# EAGLE design BATT_FLEXX (EAGLE 9.6.2)
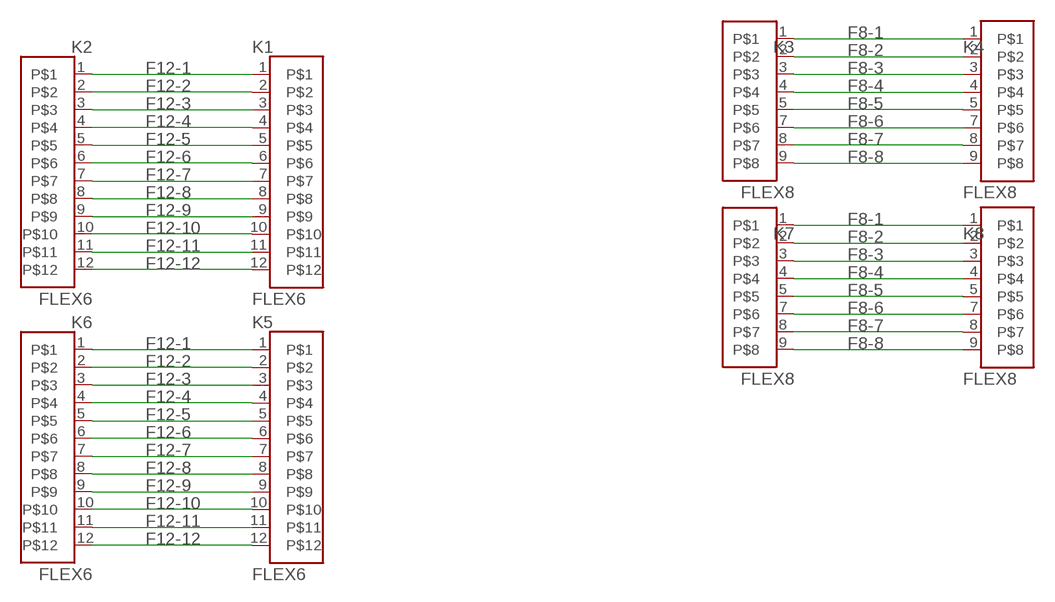
[diagram p0: schematic, sheet 1]

## Parts
K1  FLEX6  [FLEX6]
K2  FLEX6  [FLEX6]
K3  FLEX8  [FLEX8]
K4  FLEX8  [FLEX8]
K5  FLEX6  [FLEX6]
K6  FLEX6  [FLEX6]
K7  FLEX8  [FLEX8]
K8  FLEX8  [FLEX8]

## Nets
F8-1: K3.1 K4.1 K7.1 K8.1
F8-2: K3.2 K4.2 K7.2 K8.2
F8-3: K3.3 K4.3 K7.3 K8.3
F8-4: K3.4 K4.4 K7.4 K8.4
F8-5: K3.5 K4.5 K7.5 K8.5
F8-6: K3.7 K4.7 K7.7 K8.7
F8-7: K3.8 K4.8 K7.8 K8.8
F8-8: K3.9 K4.9 K7.9 K8.9
F12-1: K1.1 K2.1 K5.1 K6.1
F12-2: K1.2 K2.2 K5.2 K6.2
F12-3: K1.3 K2.3 K5.3 K6.3
F12-4: K1.4 K2.4 K5.4 K6.4
F12-5: K1.5 K2.5 K5.5 K6.5
F12-6: K1.6 K2.6 K5.6 K6.6
F12-7: K1.7 K2.7 K5.7 K6.7
F12-8: K1.8 K2.8 K5.8 K6.8
F12-9: K1.9 K2.9 K5.9 K6.9
F12-10: K1.10 K2.10 K5.10 K6.10
F12-11: K1.11 K2.11 K5.11 K6.11
F12-12: K1.12 K2.12 K5.12 K6.12

## Library data of the parts
K1 K2 K5 K6 = Flex:FLEX6: WR-FPC 1mm SMT Horiz. Bot. Contact Hinge type WR-FPC 1mm 06 pins Hinge type SMT Horizontal Bottom Contact ;=>Code : Con_FPC_ZIF_1.00_6861xx148922_686106148922 <http://katalog.we-online.de/media/images/eican/Con_FPC_ZIF_1.00_686110148922_pf2.jpg> Details see: http://katalog.we-online.de/em/datasheet/6861xx148922.pdf Created 2014-10-08, Karrer Zheng 2014 (C) Wurth Elektronik
K3 K4 K7 K8 = Flex_3mm:FLEX8: WR-FPC 1mm SMT Horiz. Bot. Contact Hinge type WR-FPC 1mm 08 pins Hinge type SMT Horizontal Bottom Contact ;=>Code : Con_FPC_ZIF_1.00_6861xx148922_686108148922 <http://katalog.we-online.de/media/images/eican/Con_FPC_ZIF_1.00_686110148922_pf2.jpg> Details see: http://katalog.we-online.de/em/datasheet/6861xx148922.pdf Created 2014-10-08, Karrer Zheng 2014 (C) Wurth Elektronik

## Board
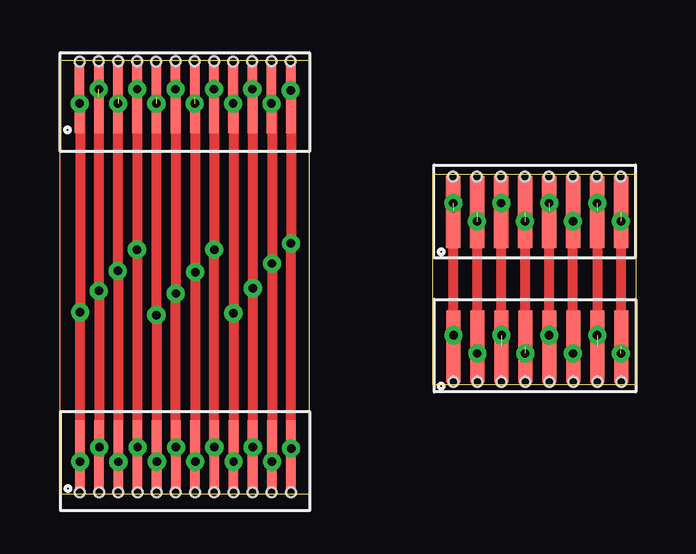
[diagram p1: board, top side]
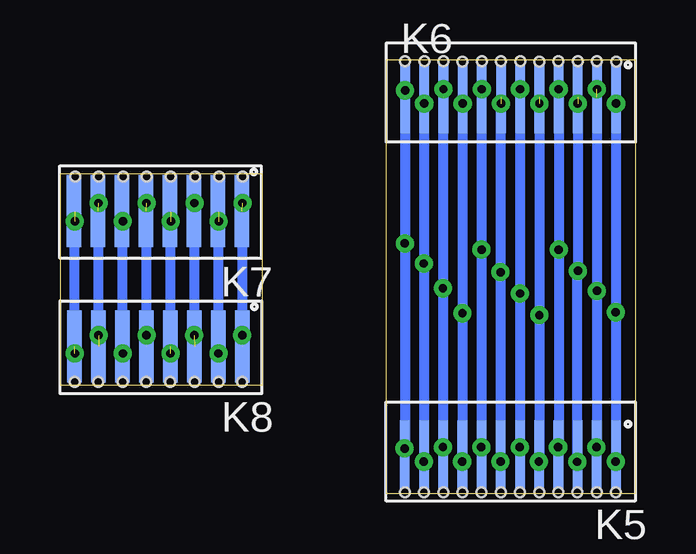
[diagram p2: board, bottom side, seen from below]

Size 24.01 x 18.1 mm. Coordinates in mm from the lower left corner, seen from the top.
Outline: 0,18.1 10.4,18.1 10.4,0 0,0 0,18.1
Outline: 15.56,13.35 24.01,13.35 24.01,4.55 15.56,4.55 15.56,13.35
Copper layers (1*16): Top 0.035mm / dielectric 1.5mm / Bottom 0.035mm
Design rules "default *": minimum track width 6mil, minimum drill 0.35mm, track to track 6mil, track to pad 6mil, pad to pad 6mil, via to via 6mil, smd to smd 6mil, copper to edge 8mil, drill to drill 6mil, minimum pad ring 10mil, minimum via ring 8mil, stop-mask expansion 4mil, vias tented up to drill 50mil, thermal gap 10mil
Holes 0.4 mm at 16.41,4.67 17.4,4.67 18.4,4.67 19.41,4.67 20.41,4.67 21.4,4.67 22.41,4.67 23.4,4.67 16.39,13.23 17.38,13.23 18.38,13.23 19.39,13.23 20.39,13.23 21.38,13.23 22.39,13.23 23.38,13.23 0.83,0.06 1.63,0.07 2.43,0.07 3.23,0.07 4.03,0.06 4.83,0.07 5.63,0.07 6.43,0.07 7.23,0.06 8.03,0.07 8.83,0.07 9.63,0.07 0.82,18.03 1.62,18.04 2.42,18.04 3.22,18.04 4.02,18.03 4.82,18.04 5.62,18.04 6.42,18.04 7.22,18.03 8.02,18.04 8.82,18.04 9.62,18.04

### Footprints (pad centres in the part's own frame; a part is rotated, then mirrored left to right if it is on the bottom)
FLEX6 = smd 0.4 x 3: 1 -2.5,-0.25; 2 -1.7,-0.25; 3 -0.9,-0.25; 4 -0.1,-0.25; 5 0.7,-0.25; 6 1.5,-0.25; 7 2.3,-0.25; 8 3.1,-0.25; 9 3.9,-0.25; 10 4.7,-0.25; 11 5.5,-0.25; 12 6.3,-0.25
FLEX8 = smd 0.6 x 3: 1 0.8,2.05; 2 1.8,2.05; 3 2.8,2.05; 4 3.8,2.05; 5 4.8,2.05; 7 5.8,2.05; 8 6.8,2.05; 9 7.8,2.05

### Placement (x,y rotation side)
K1  3.33,1.82 0 top
K2  3.32,16.79 0 top
K3  15.61,4.1 0 top
K4  15.59,9.7 0 top
K5  3.33,1.32 180 bottom
K6  3.32,16.29 180 bottom
K7  15.62,13.84 180 bottom
K8  15.6,8.2 180 bottom

### Tracks (layer width: path | path; a pad name or v marks a point on that pad's centre or on a via)
F8-1  (via drill 0.35)  (2 unrouted)
  Top 0.406: K4.1 16.41,11.74 K8.1 v16.41,6.62
  Bottom 0.406: K8.1 16.4,11.77 K7.1
  other vias: 16.4,12.13
F8-2  (via drill 0.35)  (2 unrouted)
  Top 0.406: K4.2 17.41,11.74 K8.2 v17.41,5.87 v17.4,5.86
  Bottom 0.406: K8.2 17.4,11.77 K7.2
  other vias: 17.39,11.37
F8-3  (via drill 0.35)  (2 unrouted)
  Top 0.406: K8.3 18.41,11.74 K4.3 v18.4,12.12 v18.4,12.13
  Bottom 0.406: K8.3 18.4,11.77 K7.3
  other vias: 18.41,6.62
F8-4  (via drill 0.35)  (3 unrouted)
  Top 0.406: K8.4 K4.4
  Bottom 0.406: K8.4 19.4,11.77 K7.4
  other vias: 19.39,11.37 19.4,5.86
F8-5  (via drill 0.35)  (2 unrouted)
  Top 0.406: K4.5 20.41,11.74 K8.5 v20.4,6.62
  Bottom 0.406: K8.5 20.4,11.77 K7.5
  other vias: 20.4,12.13
F8-6  (via drill 0.35)  (1 unrouted)
  Top 0.406: v21.39,5.86 21.41,5.88 K8.7 K4.7 v21.4,11.38 v21.39,11.37
  Bottom 0.406: K8.7 21.4,11.77 K7.7
F8-7  (via drill 0.35)  (3 unrouted)
  Top 0.406: K4.8 22.41,11.74 K8.8
  Bottom 0.406: K8.8 22.4,11.77 K7.8
  other vias: 22.4,12.13 22.4,6.62
F8-8  (via drill 0.35)  (3 unrouted)
  Top 0.406: K8.9 23.41,11.74 K4.9
  Bottom 0.406: K8.9 23.4,11.77 K7.9
  other vias: 23.39,5.86 23.39,11.37
F12-1  (via drill 0.35)  (2 unrouted)
  Top 0.406: K6.1 0.84,16.52 v0.84,7.58 v0.83,7.57 v0.83,1.36 v0.84,1.35
  Bottom 0.406: K5.1 v0.84,7.58 0.84,16.26 v0.82,16.28
F12-2  (via drill 0.35)  (2 unrouted)
  Top 0.406: K5.2 v1.63,8.46 v1.62,8.47 K6.2
  Bottom 0.406: K6.2 v1.62,8.47 1.62,1.97 v1.64,1.95
  other vias: 1.62,16.88
F12-3  (via drill 0.35)  (2 unrouted)
  Top 0.406: K6.3 v2.41,9.3 2.43,9.28 v2.43,1.35 v2.44,1.34
  Bottom 0.406: K5.3 2.43,9.3 v2.41,9.3 K6.3
  other vias: 2.42,16.28
F12-4  (via drill 0.35)  (2 unrouted)
  Top 0.406: K5.4 3.23,10.17 v3.21,10.19 v3.21,16.87 v3.22,16.88
  Bottom 0.406: K6.4 v3.21,10.19 3.21,1.98 v3.24,1.95
F12-5  (via drill 0.35)  (2 unrouted)
  Top 0.406: K6.5 v4.02,7.46 v4.03,7.45 v4.03,1.36 v4.04,1.35
  Bottom 0.406: K6.5 v4.02,7.46 K5.5
  other vias: 4.02,16.28
F12-6  (via drill 0.35)  (2 unrouted)
  Top 0.406: K5.6 v4.83,8.36 v4.83,16.87 v4.82,16.88
  Bottom 0.406: v4.84,1.95 v4.83,1.96 v4.83,8.36 K6.6
F12-7  (via drill 0.35)  (2 unrouted)
  Top 0.406: K6.7 v5.63,9.26 v5.64,9.25 v5.63,9.24 5.63,1.37 v5.64,1.36 v5.64,1.35
  Bottom 0.406: K5.7 v5.64,9.25 5.64,16.52 K6.7
  other vias: 5.62,16.28
F12-8  (via drill 0.35)  (2 unrouted)
  Top 0.406: K5.8 v6.43,10.19 v6.43,16.87 v6.42,16.88
  Bottom 0.406: v6.44,1.95 v6.43,1.96 v6.43,10.19 K6.8
F12-9  (via drill 0.35)  (2 unrouted)
  Top 0.406: K6.9 v7.23,7.54 v7.23,1.36 v7.24,1.35
  Bottom 0.406: K5.9 v7.23,7.54 v7.23,16.27 v7.22,16.28
F12-10  (via drill 0.35)  (2 unrouted)
  Top 0.406: K5.10 v8.04,8.58 8.04,16.86 v8.02,16.88
  Bottom 0.406: v8.04,1.95 v8.04,8.58 8.04,16.52 K6.10
F12-11  (via drill 0.35)  (2 unrouted)
  Top 0.406: K6.11 8.84,16.52 v8.84,9.61 v8.84,1.35
  Bottom 0.406: K5.11 v8.84,9.61 8.84,16.26 v8.82,16.28
F12-12  (via drill 0.35)  (2 unrouted)
  Top 0.406: K5.12 v9.63,10.45 v9.63,16.82 v9.62,16.83
  Bottom 0.406: v9.64,1.9 v9.63,1.91 v9.63,10.45 K6.12